# EAGLE design BitUCounter (EAGLE 9.2.2)
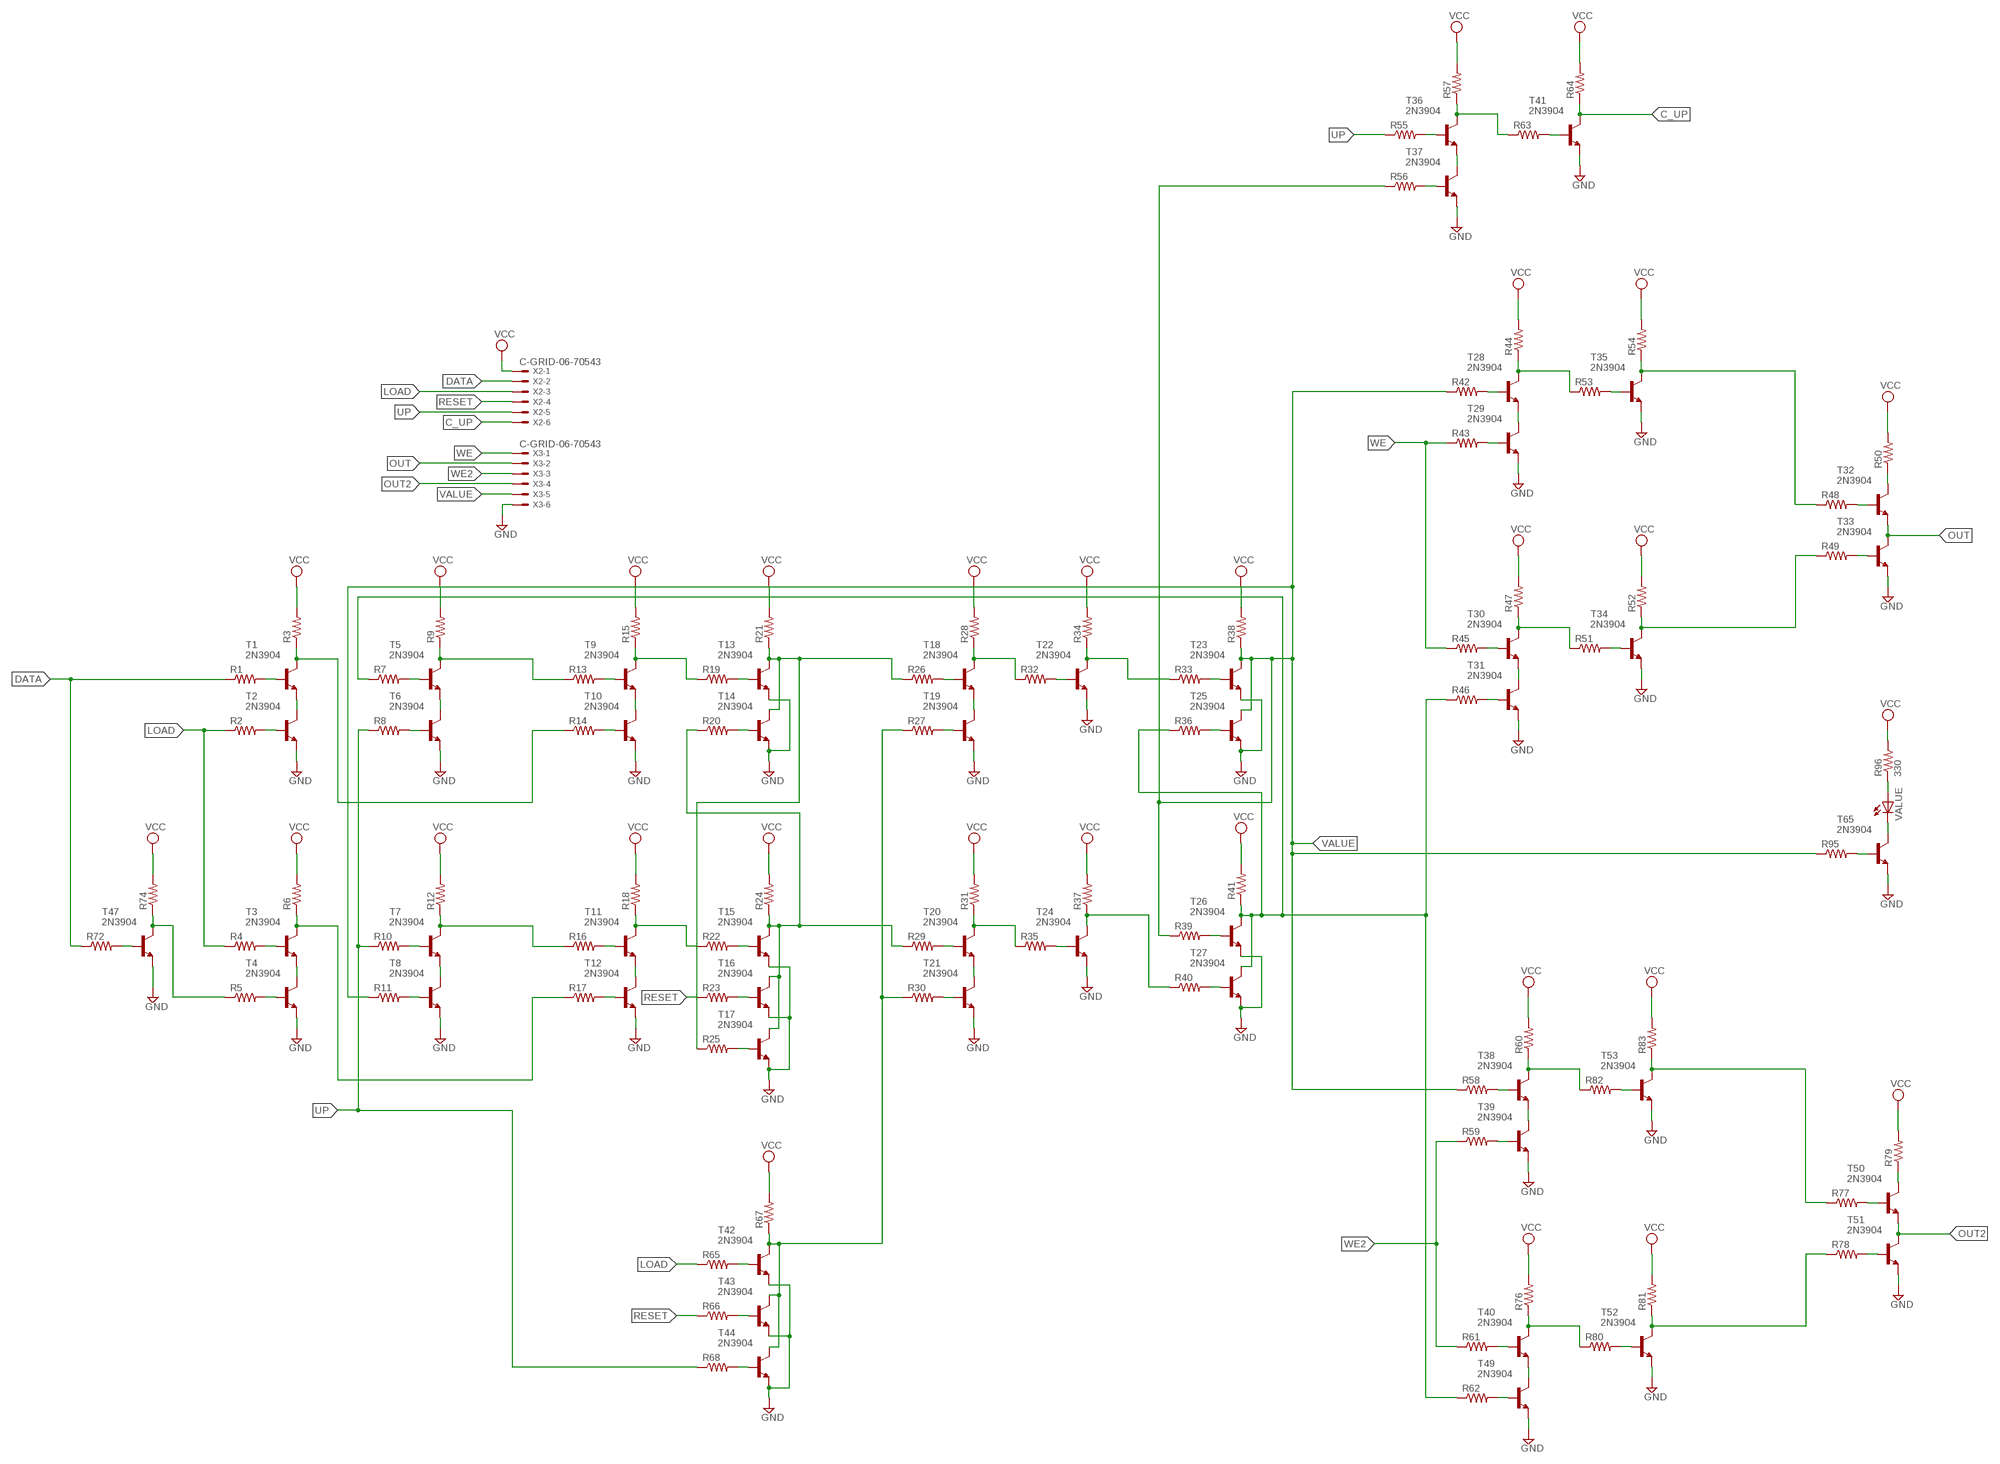
[diagram p0: schematic, sheet 1]

## Parts
R1  R-US_0309/10  [0309/10]
R2  R-US_0309/10  [0309/10]
R3  R-US_0309/10  [0309/10]
R4  R-US_0309/10  [0309/10]
R5  R-US_0309/10  [0309/10]
R6  R-US_0309/10  [0309/10]
R7  R-US_0309/10  [0309/10]
R8  R-US_0309/10  [0309/10]
R9  R-US_0309/10  [0309/10]
R10  R-US_0309/10  [0309/10]
R11  R-US_0309/10  [0309/10]
R12  R-US_0309/10  [0309/10]
R13  R-US_0309/10  [0309/10]
R14  R-US_0309/10  [0309/10]
R15  R-US_0309/10  [0309/10]
R16  R-US_0309/10  [0309/10]
R17  R-US_0309/10  [0309/10]
R18  R-US_0309/10  [0309/10]
R19  R-US_0309/10  [0309/10]
R20  R-US_0309/10  [0309/10]
R21  R-US_0309/10  [0309/10]
R22  R-US_0309/10  [0309/10]
R23  R-US_0309/10  [0309/10]
R24  R-US_0309/10  [0309/10]
R25  R-US_0309/10  [0309/10]
R26  R-US_0309/10  [0309/10]
R27  R-US_0309/10  [0309/10]
R28  R-US_0309/10  [0309/10]
R29  R-US_0309/10  [0309/10]
R30  R-US_0309/10  [0309/10]
R31  R-US_0309/10  [0309/10]
R32  R-US_0309/10  [0309/10]
R33  R-US_0309/10  [0309/10]
R34  R-US_0309/10  [0309/10]
R35  R-US_0309/10  [0309/10]
R36  R-US_0309/10  [0309/10]
R37  R-US_0309/10  [0309/10]
R38  R-US_0309/10  [0309/10]
R39  R-US_0309/10  [0309/10]
R40  R-US_0309/10  [0309/10]
R41  R-US_0309/10  [0309/10]
R42  R-US_0309/10  [0309/10]
R43  R-US_0309/10  [0309/10]
R44  R-US_0309/10  [0309/10]
R45  R-US_0309/10  [0309/10]
R46  R-US_0309/10  [0309/10]
R47  R-US_0309/10  [0309/10]
R48  R-US_0309/10  [0309/10]
R49  R-US_0309/10  [0309/10]
R50  R-US_0309/10  [0309/10]
R51  R-US_0309/10  [0309/10]
R52  R-US_0309/10  [0309/10]
R53  R-US_0309/10  [0309/10]
R54  R-US_0309/10  [0309/10]
R55  R-US_0309/10  [0309/10]
R56  R-US_0309/10  [0309/10]
R57  R-US_0309/10  [0309/10]
R58  R-US_0309/10  [0309/10]
R59  R-US_0309/10  [0309/10]
R60  R-US_0309/10  [0309/10]
R61  R-US_0309/10  [0309/10]
R62  R-US_0309/10  [0309/10]
R63  R-US_0309/10  [0309/10]
R64  R-US_0309/10  [0309/10]
R65  R-US_0309/10  [0309/10]
R66  R-US_0309/10  [0309/10]
R67  R-US_0309/10  [0309/10]
R68  R-US_0309/10  [0309/10]
R72  R-US_0309/10  [0309/10]
R74  R-US_0309/10  [0309/10]
R76  R-US_0309/10  [0309/10]
R77  R-US_0309/10  [0309/10]
R78  R-US_0309/10  [0309/10]
R79  R-US_0309/10  [0309/10]
R80  R-US_0309/10  [0309/10]
R81  R-US_0309/10  [0309/10]
R82  R-US_0309/10  [0309/10]
R83  R-US_0309/10  [0309/10]
R95  R-US_0309/10  [0309/10]
R96  330  R-US_0309/10  [0309/10]
T1  2N3904  [TO92]
T2  2N3904  [TO92]
T3  2N3904  [TO92]
T4  2N3904  [TO92]
T5  2N3904  [TO92]
T6  2N3904  [TO92]
T7  2N3904  [TO92]
T8  2N3904  [TO92]
T9  2N3904  [TO92]
T10  2N3904  [TO92]
T11  2N3904  [TO92]
T12  2N3904  [TO92]
T13  2N3904  [TO92]
T14  2N3904  [TO92]
T15  2N3904  [TO92]
T16  2N3904  [TO92]
T17  2N3904  [TO92]
T18  2N3904  [TO92]
T19  2N3904  [TO92]
T20  2N3904  [TO92]
T21  2N3904  [TO92]
T22  2N3904  [TO92]
T23  2N3904  [TO92]
T24  2N3904  [TO92]
T25  2N3904  [TO92]
T26  2N3904  [TO92]
T27  2N3904  [TO92]
T28  2N3904  [TO92]
T29  2N3904  [TO92]
T30  2N3904  [TO92]
T31  2N3904  [TO92]
T32  2N3904  [TO92]
T33  2N3904  [TO92]
T34  2N3904  [TO92]
T35  2N3904  [TO92]
T36  2N3904  [TO92]
T37  2N3904  [TO92]
T38  2N3904  [TO92]
T39  2N3904  [TO92]
T40  2N3904  [TO92]
T41  2N3904  [TO92]
T42  2N3904  [TO92]
T43  2N3904  [TO92]
T44  2N3904  [TO92]
T47  2N3904  [TO92]
T49  2N3904  [TO92]
T50  2N3904  [TO92]
T51  2N3904  [TO92]
T52  2N3904  [TO92]
T53  2N3904  [TO92]
T65  2N3904  [TO92]
VALUE  LED5MM  [LED5MM]
X2  C-GRID-06-70543  [70543-06]
X3  C-GRID-06-70543  [70543-06]

## Nets
C_UP: R64.1 T41.1(C) X2.6
DATA: R1.1 R72.1 X2.2
GND: T2.3(E) T4.3(E) T6.3(E) T8.3(E) T10.3(E) T12.3(E) T13.3(E) T14.3(E) T15.3(E) T16.3(E) T17.3(E) T19.3(E) T21.3(E) T22.3(E) T23.3(E) T24.3(E) T25.3(E) T26.3(E) T27.3(E) T29.3(E) T31.3(E) T33.3(E) T34.3(E) T35.3(E) T37.3(E) T39.3(E) T41.3(E) T42.3(E) T43.3(E) T44.3(E) T47.3(E) T49.3(E) T51.3(E) T52.3(E) T53.3(E) T65.3(E) X3.6
LOAD: R2.1 R4.1 R65.1 X2.3
N$1: R5.1 R74.1 T47.1(C)
N$2: R72.2 T47.2(B)
N$4: R7.1 R36.1 R41.1 R46.1 R62.1 T26.1(C) T27.1(C)
N$5: R6.1 R17.1 T3.1(C)
N$9: T3.3(E) T4.1(C)
N$10: R5.2 T4.2(B)
N$11: R4.2 T3.2(B)
N$12: R2.2 T2.2(B)
N$13: R1.2 T1.2(B)
N$14: T1.3(E) T2.1(C)
N$15: R3.1 R14.1 T1.1(C)
N$16: R9.1 R13.1 T5.1(C)
N$17: R7.2 T5.2(B)
N$18: R8.2 T6.2(B)
N$19: T5.3(E) T6.1(C)
N$20: R12.1 R16.1 T7.1(C)
N$21: R10.2 T7.2(B)
N$22: R11.2 T8.2(B)
N$23: T7.3(E) T8.1(C)
N$24: R18.1 R22.1 T11.1(C)
N$25: R16.2 T11.2(B)
N$26: R17.2 T12.2(B)
N$27: T11.3(E) T12.1(C)
N$28: R14.2 T10.2(B)
N$29: T9.3(E) T10.1(C)
N$30: R15.1 R19.1 T9.1(C)
N$31: R13.2 T9.2(B)
N$32: R21.1 R25.1 R26.1 T13.1(C) T14.1(C)
N$33: R58.2 T38.2(B)
N$34: R19.2 T13.2(B)
N$35: R20.2 T14.2(B)
N$36: R20.1 R24.1 R29.1 T15.1(C) T16.1(C) T17.1(C)
N$38: R59.2 T39.2(B)
N$39: T38.3(E) T39.1(C)
N$40: R22.2 T15.2(B)
N$41: R23.2 T16.2(B)
N$42: R25.2 T17.2(B)
N$43: R30.2 T21.2(B)
N$44: T20.3(E) T21.1(C)
N$45: R31.1 R35.1 T20.1(C)
N$46: R29.2 T20.2(B)
N$47: R35.2 T24.2(B)
N$48: R60.1 R82.1 T38.1(C)
N$49: R26.2 T18.2(B)
N$50: R27.2 T19.2(B)
N$51: T18.3(E) T19.1(C)
N$52: R28.1 R32.1 T18.1(C)
N$53: R32.2 T22.2(B)
N$54: R33.1 R34.1 T22.1(C)
N$55: R82.2 T53.2(B)
N$56: R77.1 R83.1 T53.1(C)
N$57: R78.1 R81.1 T52.1(C)
N$58: R36.2 T25.2(B)
N$59: R33.2 T23.2(B)
N$61: R80.2 T52.2(B)
N$62: R39.2 T26.2(B)
N$63: R40.2 T27.2(B)
N$64: R42.2 T28.2(B)
N$65: R43.2 T29.2(B)
N$66: T28.3(E) T29.1(C)
N$67: R44.1 R53.1 T28.1(C)
N$68: R53.2 T35.2(B)
N$69: R48.1 R54.1 T35.1(C)
N$70: R49.1 R52.1 T34.1(C)
N$71: R51.2 T34.2(B)
N$72: R47.1 R51.1 T30.1(C)
N$73: T30.3(E) T31.1(C)
N$74: R46.2 T31.2(B)
N$75: R45.2 T30.2(B)
N$76: R48.2 T32.2(B)
N$77: R50.1 T32.1(C)
N$78: R76.1 R80.1 T40.1(C)
N$79: R49.2 T33.2(B)
N$80: T40.3(E) T49.1(C)
N$81: R62.2 T49.2(B)
N$82: R61.2 T40.2(B)
N$83: R77.2 T50.2(B)
N$84: R57.1 R63.1 T36.1(C)
N$85: T36.3(E) T37.1(C)
N$86: R56.2 T37.2(B)
N$87: R55.2 T36.2(B)
N$88: R79.1 T50.1(C)
N$89: R63.2 T41.2(B)
N$90: R78.2 T51.2(B)
N$91: R65.2 T42.2(B)
N$97: R66.2 T43.2(B)
N$98: R68.2 T44.2(B)
N$100: R27.1 R30.1 R67.1 T42.1(C) T43.1(C) T44.1(C)
N$102: R37.1 R40.1 T24.1(C)
N$121: R96.1 VALUE.A
N$122: R95.2 T65.2(B)
N$124: T65.1(C) VALUE.K(C)
OUT: T32.3(E) T33.1(C) X3.2
OUT2: T50.3(E) T51.1(C) X3.4
RESET: R23.1 R66.1 X2.4
UP: R8.1 R10.1 R55.1 R68.1 X2.5
VALUE: R11.1 R38.1 R39.1 R42.1 R56.1 R58.1 R95.1 T23.1(C) T25.1(C) X3.5
VCC: R3.2 R6.2 R9.2 R12.2 R15.2 R18.2 R21.2 R24.2 R28.2 R31.2 R34.2 R37.2 R38.2 R41.2 R44.2 R47.2 R50.2 R52.2 R54.2 R57.2 R60.2 R64.2 R67.2 R74.2 R76.2 R79.2 R81.2 R83.2 R96.2 X2.1
WE: R43.1 R45.1 X3.1
WE2: R59.1 R61.1 X3.3

## Library data of the parts
R1-R68 R72 R74 R76-R83 R95 R96 = resistor:R-US_: RESISTOR, American symbol
T1-T44 T47 T49-T53 T65 = transistor:2N3904: NPN TRANSISTOR
VALUE = led:LED: LED OSRAM: - CHIPLED LG R971, LG N971, LY N971, LG Q971, LY Q971, LO R971, LY R971 LH N974, LH R974 LS Q976, LO Q976, LY Q976 LO Q996 - Hyper CHIPLED LW Q18S LB Q993, LB Q99A, LB R99A - SideLED LS A670, LO A670, LY A670, LG A670, LP A670 LB A673, LV A673, LT A673, LW A673 LH A674 LY A675 LS A676, LA A676, LO A676, LY A676, LW A676 LS A679, LY A679, LG A679 - Hyper Micro SIDELED® LS Y876, LA Y876, LO Y876, LY Y876 LT Y87S - SmartLED LW L88C, LW L88S LB L89C, LB L89S, LG L890 LS L89K, LO L89K, LY L89K LS L896, LA L896, LO L896, LY L896 - TOPLED LS T670, LO T670, LY T670, LG T670, LP T670 LSG T670, LSP T670, LSY T670, LOP T670, LYG T670 LG T671, LOG T671, LSG T671 LB T673, LV T673, LT T673, LW T673 LH T674 LS T676, LA T676, LO T676, LY T676, LB T676, LH T676, LSB T676, LW T676 LB T67C, LV T67C, LT T67C, LS T67K, LO T67K, LY T67K, LW E67C LS E67B, LA E67B, LO E67B, LY E67B, LB E67C, LV E67C, LT E67C LW T67C LS T679, LY T679, LG T679 LS T770, LO T770, LY T770, LG T770, LP T770 LB T773, LV T773, LT T773, LW T773 LH T774 LS E675, LA E675, LY E675, LS T675 LS T776, LA T776, LO T776, LY T776, LB T776 LHGB T686 LT T68C, LB T68C - Hyper Mini TOPLED® LB M676 - Mini TOPLED Santana® LG M470 LS M47K, LO M47K, LY M47K Source: http://www.osram.convergy.de LUXEON: - LUMILED® LXK2-PW12-R00, LXK2-PW12-S00, LXK2-PW14-U00, LXK2-PW14-V00 LXK2-PM12-R00, LXK2-PM12-S00, LXK2-PM14-U00 LXK2-PE12-Q00, LXK2-PE12-R00, LXK2-PE12-S00, LXK2-PE14-T00, LXK2-PE14-U00 LXK2-PB12-K00, LXK2-PB12-L00, LXK2-PB12-M00, LXK2-PB14-N00, LXK2-PB14-P00, LXK2-PB14-Q00 LXK2-PR12-L00, LXK2-PR12-M00, LXK2-PR14-Q00, LXK2-PR14-R00 LXK2-PD12-Q00, LXK2-PD12-R00, LXK2-PD12-S00 LXK2-PH12-R00, LXK2-PH12-S00 LXK2-PL12-P00, LXK2-PL12-Q00, LXK2-PL12-R00 Source: www.luxeon.com KINGBRIGHT: KA-3528ASYC Source: www.kingbright.com
X2 X3 = con-molex:C-GRID-06: CONNECTOR wire to board 2.54 mm (0.100") pitch header; MF: MOLEX; OC_FARNELL: unknown; OC_NEWARK: unknown

## Board
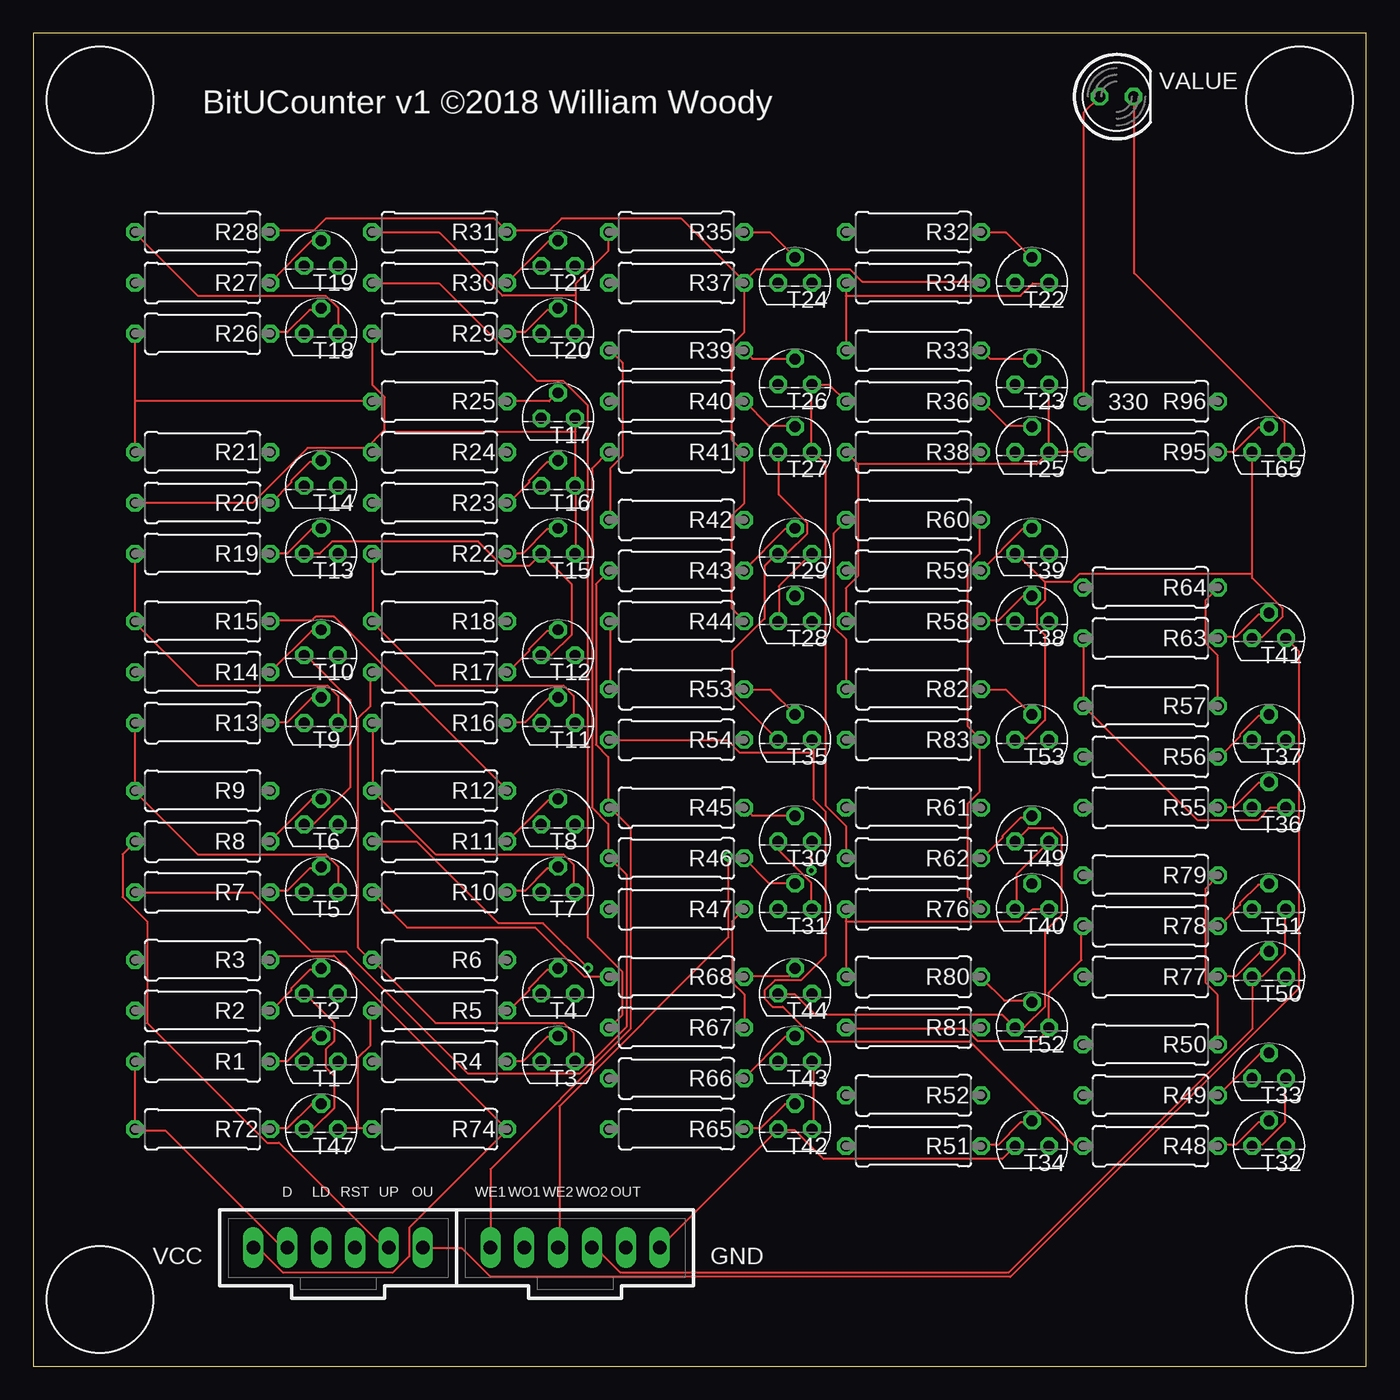
[diagram p1: board, top side]
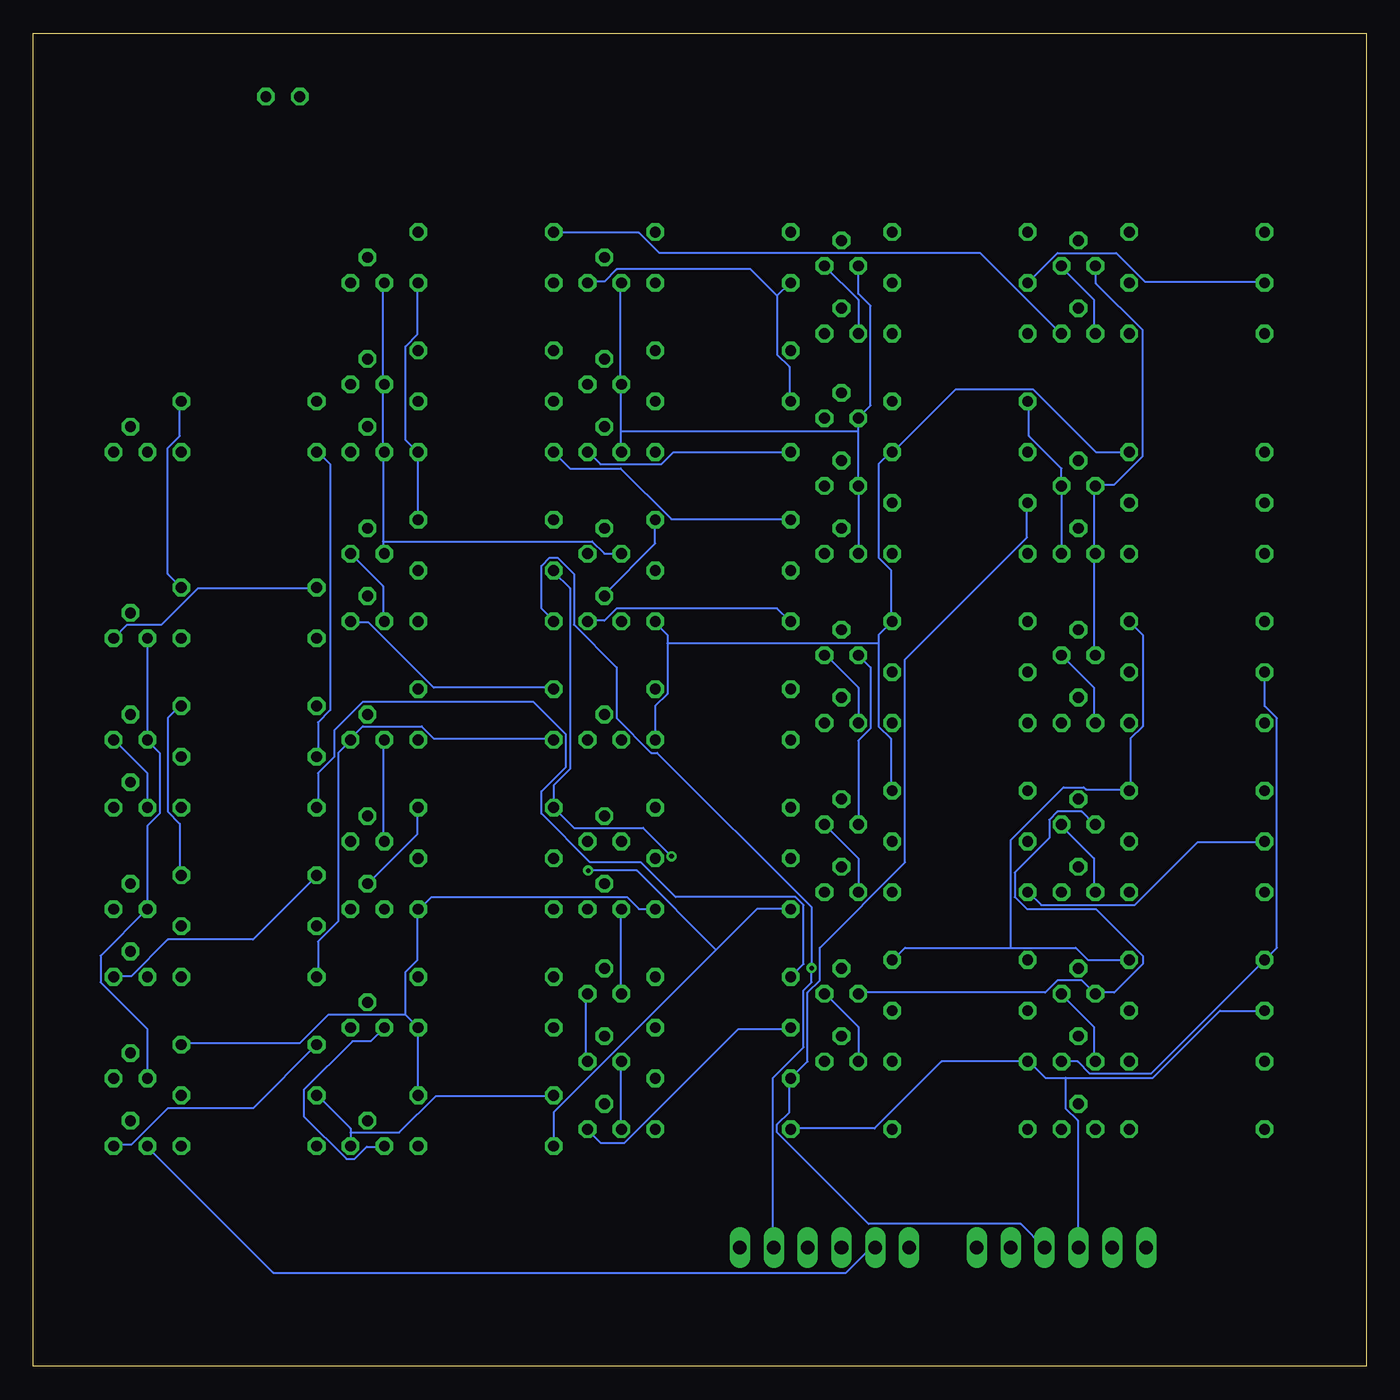
[diagram p2: board, bottom side, seen from below]

Size 100 x 100 mm. Coordinates in mm from the lower left corner, seen from the top.
Outline: 0,0 100,0 100,100 0,100 0,0
Copper layers (1*16): Top 0.035mm / dielectric 1.5mm / Bottom 0.035mm
Design rules "default": minimum track width 6mil, minimum drill 0.35mm, track to track 6mil, track to pad 6mil, pad to pad 6mil, via to via 6mil, smd to smd 6mil, copper to edge 40mil, drill to drill 6mil, minimum pad ring 10mil, minimum via ring 8mil, stop-mask expansion 4mil, vias tented up to drill 0mil, thermal gap 10mil

### Footprints (pad centres in the part's own frame; a part is rotated, then mirrored left to right if it is on the bottom)
0309/10 = drill 0.813 octagon: 1 -5.08,0; 2 5.08,0
TO92 = drill 0.813 octagon: 1 1.27,0; 2 0,1.905; 3 -1.27,0
LED5MM = drill 0.813 octagon: A -1.27,0; K 1.27,0
70543-06 = drill 1.016 long: 1 -6.35,0; 2 -3.81,0; 3 -1.27,0; 4 1.27,0; 5 3.81,0; 6 6.35,0

### Placement (x,y rotation side)
R1  12.7,22.86 0 top
R2  12.7,26.67 0 top
R3  12.7,30.48 0 top
R4  30.48,22.86 0 top
R5  30.48,26.67 0 top
R6  30.48,30.48 0 top
R7  12.7,35.56 0 top
R8  12.7,39.37 0 top
R9  12.7,43.18 0 top
R10  30.48,35.56 0 top
R11  30.48,39.37 0 top
R12  30.48,43.18 0 top
R13  12.7,48.26 0 top
R14  12.7,52.07 0 top
R15  12.7,55.88 0 top
R16  30.48,48.26 0 top
R17  30.48,52.07 0 top
R18  30.48,55.88 0 top
R19  12.7,60.96 0 top
R20  12.7,64.77 0 top
R21  12.7,68.58 0 top
R22  30.48,60.96 0 top
R23  30.48,64.77 0 top
R24  30.48,68.58 0 top
R25  30.48,72.39 0 top
R26  12.7,77.47 0 top
R27  12.7,81.28 0 top
R28  12.7,85.09 0 top
R29  30.48,77.47 0 top
R30  30.48,81.28 0 top
R31  30.48,85.09 0 top
R32  66.04,85.09 0 top
R33  66.04,76.2 0 top
R34  66.04,81.28 0 top
R35  48.26,85.09 0 top
R36  66.04,72.39 0 top
R37  48.26,81.28 0 top
R38  66.04,68.58 0 top
R39  48.26,76.2 0 top
R40  48.26,72.39 0 top
R41  48.26,68.58 0 top
R42  48.26,63.5 0 top
R43  48.26,59.69 0 top
R44  48.26,55.88 0 top
R45  48.26,41.91 0 top
R46  48.26,38.1 0 top
R47  48.26,34.29 0 top
R48  83.82,16.51 0 top
R49  83.82,20.32 0 top
R50  83.82,24.13 0 top
R51  66.04,16.51 0 top
R52  66.04,20.32 0 top
R53  48.26,50.8 0 top
R54  48.26,46.99 0 top
R55  83.82,41.91 0 top
R56  83.82,45.72 0 top
R57  83.82,49.53 0 top
R58  66.04,55.88 0 top
R59  66.04,59.69 0 top
R60  66.04,63.5 0 top
R61  66.04,41.91 0 top
R62  66.04,38.1 0 top
R63  83.82,54.61 0 top
R64  83.82,58.42 0 top
R65  48.26,17.78 0 top
R66  48.26,21.59 0 top
R67  48.26,25.4 0 top
R68  48.26,29.21 0 top
R72  12.7,17.78 0 top
R74  30.48,17.78 0 top
R76  66.04,34.29 0 top
R77  83.82,29.21 0 top
R78  83.82,33.02 0 top
R79  83.82,36.83 0 top
R80  66.04,29.21 0 top
R81  66.04,25.4 0 top
R82  66.04,50.8 0 top
R83  66.04,46.99 0 top
R95  83.82,68.58 0 top
R96  83.82,72.39 0 top
T1  21.59,22.86 0 top
T2  21.59,27.94 0 top
T3  39.37,22.86 0 top
T4  39.37,27.94 0 top
T5  21.59,35.56 0 top
T6  21.59,40.64 0 top
T7  39.37,35.56 0 top
T8  39.37,40.64 0 top
T9  21.59,48.26 0 top
T10  21.59,53.34 0 top
T11  39.37,48.26 0 top
T12  39.37,53.34 0 top
T13  21.59,60.96 0 top
T14  21.59,66.04 0 top
T15  39.37,60.96 0 top
T16  39.37,66.04 0 top
T17  39.37,71.12 0 top
T18  21.59,77.47 0 top
T19  21.59,82.55 0 top
T20  39.37,77.47 0 top
T21  39.37,82.55 0 top
T22  74.93,81.28 0 top
T23  74.93,73.66 0 top
T24  57.15,81.28 0 top
T25  74.93,68.58 0 top
T26  57.15,73.66 0 top
T27  57.15,68.58 0 top
T28  57.15,55.88 0 top
T29  57.15,60.96 0 top
T30  57.15,39.37 0 top
T31  57.15,34.29 0 top
T32  92.71,16.51 0 top
T33  92.71,21.59 0 top
T34  74.93,16.51 0 top
T35  57.15,46.99 0 top
T36  92.71,41.91 0 top
T37  92.71,46.99 0 top
T38  74.93,55.88 0 top
T39  74.93,60.96 0 top
T40  74.93,34.29 0 top
T41  92.71,54.61 0 top
T42  57.15,17.78 0 top
T43  57.15,22.86 0 top
T44  57.15,27.94 0 top
T47  21.59,17.78 0 top
T49  74.93,39.37 0 top
T50  92.71,29.21 0 top
T51  92.71,34.29 0 top
T52  74.93,25.4 0 top
T53  74.93,46.99 0 top
T65  92.71,68.58 0 top
VALUE  81.28,95.25 0 top
X2  22.86,8.89 0 top
X3  40.64,8.89 0 top

### Tracks (layer width: path | path; a pad name or v marks a point on that pad's centre or on a via)
C_UP
  Top 0.152: T41.1 94.94,53.65 94.94,28.35 73.3,6.71 34.29,6.71 32.16,8.84 29.26,8.84 X2.6
  Bottom 0.152: T41.1 92.96,55.63 90.37,55.63 87.63,58.37 78.79,58.37 R64.1
DATA
  Top 0.152: R1.1 R72.1 7.62,17.68 9.91,17.68 18.59,8.99 19.05,8.99 X2.2
GND
  Top 0.152: T47.3 20.42,17.83 21.03,17.83 22.55,19.36 22.55,21.79 21.95,22.4 21.95,23.77 22.55,24.38 22.55,25.76 20.42,27.89 T2.3 | T6.3 20.42,40.69 21.03,40.69 23.77,43.43 23.77,49.99 20.42,53.34 T10.3 | T35.3 52.43,50.44 52.43,53.65 54.86,56.08 54.86,60.05 55.78,60.96 T29.3 56.54,60.96 58.06,62.48 58.06,63.25 55.93,65.38 55.93,68.58 T27.3 | T12.3 38.86,53.34 40.39,54.86 40.39,58.67 T15.3 37.19,60.05 35.2,60.05 33.38,61.87 22.4,61.87 21.49,60.96 T13.3 | X3.6 T42.3 55.93,17.68 57.15,17.68 59.28,15.54 72.69,15.54 T34.3 | T44.3 55.93,27.89 57.15,27.89 58.67,26.36 72.69,26.36 T52.3 73.76,25.45 74.37,25.45 75.89,26.98 75.89,32.61 77.11,33.83 77.11,39.78 76.5,40.39 74.68,40.39 T49.3 | 75.89,58.83 75.89,57.45 75.29,56.84 75.29,55.47 75.89,54.86 75.89,48.46 74.52,47.09 73.76,47.09 T53.3 | 75.89,58.83 73.76,60.96 T39.3 | 91.44,59.44 91.44,59.13 93.73,56.84 93.73,56.24 92.2,54.71 91.44,54.71 T41.3 | 91.44,59.44 T65.3 | 75.89,58.83 77.88,58.83 78.49,59.44 91.44,59.44
  Bottom 0.152: T4.3 38.1,28.04 24.08,28.04 23.16,28.96 21.34,28.96 T2.3 20.27,28.04 18.9,28.04 16.76,30.18 16.76,30.79 20.27,34.29 25.45,34.29 26.36,35.2 26.36,37.03 23.77,39.62 23.77,41 23.16,41.6 21.34,41.6 20.42,40.69 T6.3 | 20.42,60.96 20.42,65.99 T14.3 20.27,66.14 18.9,66.14 16.76,68.28 16.76,77.72 20.27,81.23 20.27,82.45 T19.3 | 20.42,60.96 20.42,53.34 T10.3 | 20.42,60.96 T13.3 | 55.93,70.1 55.93,73.61 T26.3 55.93,73.76 55.93,81.23 T24.3 | 55.93,70.1 55.93,68.58 T27.3 | T8.3 38.1,46.94 37.19,47.85 37.19,52.43 T12.3 | T15.3 T16.3 38.1,70.1 | 38.1,70.1 T17.3 38.1,71.17 37.19,72.08 37.19,79.55 38.1,80.47 T21.3 | 38.1,70.1 55.93,70.1 | T42.3 55.93,17.83 55.93,22.86 T43.3 | T44.3 55.93,28.04 55.93,34.29 T31.3 | T52.3 74.68,24.38 76.05,24.38 79.7,20.73 79.7,18.75 76.5,15.54 75.89,15.54 74.98,16.46 73.76,16.46 T34.3 | T49.3 73.76,39.47 73.76,46.94 T53.3 | 73.76,68.58 73.76,61.87 | 73.76,61.87 73.76,60.96 T39.3 | 73.76,68.58 73.76,73.61 T23.3 73.76,73.76 73.76,81.23 T22.3 | 73.76,68.58 T25.3 | T33.3 91.44,25.3 94.94,28.8 94.94,30.79 T51.3 91.44,40.54 90.53,41.45 90.53,46.02 91.44,46.94 T37.3 T41.3 | T29.3 57.15,60.96 58.06,61.87 73.76,61.87
LOAD
  Bottom 0.152: R2.1 10.97,26.67 16,21.64 22.55,21.64 | 22.55,21.64 24.08,21.64 25.3,22.86 R4.1 31.85,22.86 36.88,17.83 43.13,17.83 R65.1 | 22.55,21.64 22.55,19.36 21.64,18.44 21.64,8.99 X2.3
N$1
  Top 0.152: 24.38,17.83 25.3,17.83 R74.1 | 24.38,17.83 22.86,17.83 T47.1 | 24.38,17.83 24.38,23.16 25.3,24.08 25.3,26.67 R5.1
N$2
  Top 0.152: R72.2 17.83,17.83 19.05,17.83 20.88,19.66 21.49,19.66 T47.2
N$4
  Top 0.152: R7.1 7.62,35.51 16.46,35.51 20.88,31.09 23.47,31.09 32.61,21.95 41,21.95 44.5,25.45 44.5,36.88 43.28,38.1 R46.1 43.13,38.1 43.13,40.69 41.91,41.91 41.91,67.36 43.13,68.58 R41.1 | R36.1 59.74,73.61 58.52,73.61 T26.1 58.37,73.61 58.37,68.58 T27.1 58.52,68.58 59.44,67.67 59.44,42.06 60.96,40.54 R62.1
  Bottom 0.152: R41.1 51.97,68.58 52.88,67.67 57.45,67.67 58.37,68.58 T27.1
N$5
  Top 0.152: T3.1 40.54,22.86 40.54,24.99 39.78,25.76 30.18,25.76 25.45,30.48 R6.1 25.3,30.48 24.38,31.39 24.38,48.62 25.3,49.53 25.3,51.97 R17.1
N$9
  Bottom 0.152: T3.3 38.1,25.45 40.54,27.89 T4.1
N$10
  Top 0.152: R5.2 35.66,26.67 37.19,28.19 37.19,28.35 38.56,29.72 39.32,29.72 T4.2
N$11
  Top 0.152: R4.2 36.73,22.86 38.56,24.69 39.32,24.69 T3.2
N$12
  Top 0.152: R2.2 17.83,26.67 19.36,28.19 19.36,28.35 20.73,29.72 21.49,29.72 T2.2
N$13
  Top 0.152: R1.2 19.05,22.86 20.88,24.69 21.49,24.69 T1.2
N$14
  Bottom 0.152: T1.3 20.42,22.86 20.42,25.45 22.86,27.89 T2.1
N$15
  Bottom 0.152: T1.1 21.64,22.86 20.73,21.95 16.15,21.95 R3.1 6.71,31.39 6.71,48.62 7.62,49.53 R14.1
N$16
  Top 0.152: R13.1 R9.1 7.62,43.13 12.34,38.41 21.95,38.41 22.86,37.49 T5.1
N$17
  Top 0.152: R7.2 17.83,35.66 19.05,35.66 20.73,37.34 21.49,37.34 T5.2
N$18
  Top 0.152: R8.2 17.83,39.47 20.88,42.52 21.49,42.52 T6.2
N$19
  Bottom 0.152: T5.3 20.42,35.66 20.42,38.1 22.86,40.54 T6.1
N$20
  Top 0.152: R16.1 25.45,48.16 25.45,43.28 R12.1 30.18,38.41 39.78,38.41 40.54,37.64 40.54,35.66 T7.1
N$21
  Top 0.152: R10.2 35.66,35.66 36.88,35.66 38.56,37.34 39.32,37.34 T7.2
N$22
  Top 0.152: R11.2 38.71,42.52 39.32,42.52 T8.2
N$23
  Bottom 0.152: T7.3 38.1,38.1 T8.1
N$24
  Top 0.152: R22.1 25.45,60.96 25.45,55.93 R18.1 25.45,55.78 30.18,51.05 39.78,51.05 40.54,50.29 40.54,48.31 T11.1
N$25
  Top 0.152: R16.2 35.66,48.31 36.88,48.31 38.71,50.14 39.32,50.14 T11.2
N$26
  Top 0.152: R17.2 35.66,52.12 37.19,53.65 37.19,53.8 38.56,55.17 39.32,55.17 T12.2
N$27
  Bottom 0.152: T11.3 38.1,50.9 40.54,53.34 T12.1
N$28
  Top 0.152: R14.2 20.88,55.17 21.49,55.17 T10.2
N$29
  Bottom 0.152: T10.1 20.42,50.9 20.42,48.31 T9.3
N$30
  Top 0.152: R19.1 R15.1 7.62,55.78 12.34,51.05 22.1,51.05 22.86,50.29 T9.1
N$31
  Top 0.152: R13.2 17.83,48.31 19.05,48.31 20.88,50.14 21.49,50.14 T9.2
N$32
  Top 0.152: R26.1 7.62,72.39 | 7.62,72.39 R21.1 | R25.1 7.62,72.39
  Bottom 0.152: T13.1 T14.1 22.86,67.36 25.3,69.8 25.3,72.39 R25.1
N$33
  Top 0.152: R58.2 71.17,55.93 72.39,55.93 74.22,57.76 74.83,57.76 T38.2
N$34
  Top 0.152: R19.2 19.05,60.96 20.88,62.79 21.49,62.79 T13.2
N$35
  Top 0.152: R20.2 17.83,64.77 19.36,66.29 19.36,66.45 20.73,67.82 21.49,67.82 T14.2
N$36
  Top 0.152: T15.1 40.69,60.96 40.69,65.99 T16.1 40.69,66.14 40.69,70.1 | 40.69,70.1 40.69,71.02 T17.1 | R20.1 16.46,64.77 20.57,68.89 24.99,68.89 | 24.99,68.89 25.3,68.58 R24.1 24.99,68.89 | 24.99,68.89 26.21,70.1 | 26.21,70.1 26.36,70.26 26.36,72.69 25.45,73.61 25.45,77.42 R29.1 | 26.21,70.1 40.69,70.1
N$38
  Top 0.152: R59.2 74.22,62.79 74.83,62.79 T39.2
N$39
  Bottom 0.152: T39.1 73.76,58.52 73.76,55.93 T38.3
N$40
  Top 0.152: R22.2 36.73,60.96 38.56,62.79 39.32,62.79 T15.2
N$41
  Top 0.152: R23.2 35.66,64.77 37.19,66.29 37.19,66.45 38.56,67.82 39.32,67.82 T16.2
N$42
  Top 0.152: R25.2 38.71,72.39 39.32,73 T17.2
N$43
  Top 0.152: R30.2 38.71,84.43 39.32,84.43 T21.2
N$44
  Bottom 0.152: T20.3 38.1,80.01 T21.1
N$45
  Top 0.152: 40.69,80.31 40.69,81.23 43.13,83.67 43.13,85.04 R35.1 | 40.69,80.31 40.69,77.57 T20.1 | 40.69,80.31 35.2,80.31 30.48,85.04 25.45,85.04 R31.1
N$46
  Top 0.152: R29.2 35.66,77.57 36.88,77.57 38.56,79.25 39.32,79.25 T20.2
N$47
  Top 0.152: R35.2 53.34,85.04 55.32,85.04 57.15,83.21 T24.2
N$48
  Top 0.152: R82.1 60.96,54.56 60.05,55.47 60.05,62.48 60.96,63.4 R60.1
  Bottom 0.152: T38.1 76.2,55.78 74.83,55.78 69.95,50.9 60.96,50.9 R82.1
N$49
  Top 0.152: R26.2 17.83,77.57 19.05,77.57 20.73,79.25 21.49,79.25 T18.2
N$50
  Top 0.152: R27.2 17.83,81.38 20.88,84.43 21.49,84.43 T19.2
N$51
  Bottom 0.152: T18.3 20.42,77.57 20.42,80.01 22.86,82.45 T19.1
N$52
  Top 0.152: T18.1 22.86,79.4 21.95,80.31 12.34,80.31 7.62,85.04 R28.1
  Bottom 0.152: R32.1 60.96,85.04 54.56,85.04 53.03,83.52 28.96,83.52 22.86,77.42 T18.1
N$53
  Top 0.152: R32.2 71.17,85.04 73,85.04 74.83,83.21 T22.2
N$54
  Top 0.152: R34.1 60.96,80.31 | 60.96,80.31 R33.1 | 60.96,80.31 74.07,80.31 74.98,81.23 76.2,81.23 T22.1
N$55
  Top 0.152: R82.2 71.17,50.75 73,50.75 74.83,48.92 T53.2
N$56
  Bottom 0.152: R83.1 60.96,47.09 69.95,47.09 70.87,48.01 75.29,48.01 76.2,47.09 T53.1 76.2,46.94 77.11,46.02 77.11,33.38 78.64,31.85 78.64,29.26 R77.1
N$57
  Top 0.152: R81.1 60.96,25.3 69.95,25.3 70.87,24.38 75.29,24.38 76.2,25.3 T52.1 76.2,28.04 78.64,30.48 78.64,32.92 R78.1
N$58
  Top 0.152: T25.2 74.83,70.56 73,70.56 71.17,72.39 R36.2
N$59
  Top 0.152: T23.2 74.83,75.59 71.78,75.59 71.17,76.2 R33.2
N$61
  Top 0.152: T52.2 74.83,27.43 72.85,27.43 71.17,29.11 R80.2
N$62
  Top 0.152: R39.2 53.95,75.59 57.15,75.59 T26.2
N$63
  Top 0.152: R40.2 55.17,70.56 57.15,70.56 T27.2
N$64
  Bottom 0.152: R42.2 53.34,61.72 57.15,57.91 T28.2
N$65
  Top 0.152: R43.2 53.34,59.74 56.39,62.79 57.15,62.79 T29.2
N$66
  Top 0.152: T28.3 55.93,55.93 55.93,58.52 58.37,60.96 T29.1
N$67
  Top 0.152: R53.1 43.28,50.9 43.28,55.78 R44.1
  Bottom 0.152: T28.1 58.37,55.93 57.15,55.93 56.24,56.84 44.2,56.84 43.28,55.93 R44.1
N$68
  Top 0.152: R53.2 53.34,50.75 55.32,50.75 57.15,48.92 T35.2
N$69
  Top 0.152: 58.52,46.02 58.52,46.94 T35.1 | 58.52,46.02 58.52,42.52 59.44,41.6 59.44,30.79 57.61,28.96 55.63,28.96 54.86,28.19 54.86,27.58 55.47,26.98 56.24,26.98 58.83,24.38 70.26,24.38 78.03,16.61 78.64,16.61 R48.1 | 58.52,46.02 53.03,46.02 52.12,46.94 43.28,46.94 R54.1
N$70
  Bottom 0.152: 76.2,17.53 76.2,17.83 78.64,20.27 R49.1 | 76.2,17.53 T34.1 | 76.2,17.53 72.54,17.53 69.8,20.27 60.96,20.27 R52.1
N$71
  Top 0.152: R51.2 71.17,16.61 72.39,16.61 74.07,18.29 74.83,18.29 T34.2
N$72  (via drill 0.35)
  Top 0.152: v58.37,37.19 58.37,39.32 T30.1
  Bottom 0.152: R51.1 60.96,19.05 48.77,31.24 | 48.77,31.24 45.72,34.29 R47.1 | v58.37,37.19 54.71,37.19 48.77,31.24
N$73
  Top 0.152: T30.3 55.93,39.32 55.93,38.71 58.37,36.27 58.37,34.29 T31.1
N$74
  Top 0.152: R46.2 55.17,36.27 57.15,36.27 T31.2
N$75
  Top 0.152: R45.2 53.95,41.3 57.15,41.3 T30.2
N$76
  Top 0.152: R48.2 89,16.61 90.22,16.61 91.9,18.29 92.66,18.29 T32.2
N$77
  Bottom 0.152: R50.1 83.52,19.36 89.92,19.36 92.66,16.61 93.88,16.61 T32.1
N$78
  Top 0.152: R76.1 60.96,33.38 | 60.96,33.38 R80.1 | T40.1 74.98,34.29 74.07,33.38 60.96,33.38
N$79
  Top 0.152: R49.2 92.05,23.47 92.66,23.47 T33.2
N$80
  Top 0.152: T40.3 73.76,34.29 73.76,36.88 76.2,39.32 T49.1
N$81
  Top 0.152: R62.2 71.17,38.1 72.69,39.62 72.69,39.78 74.07,41.15 74.83,41.15 T49.2
N$82
  Bottom 0.152: R61.2 71.17,41.91 71.17,39.93 74.83,36.27 T40.2
N$83
  Top 0.152: R77.2 89,29.26 90.22,29.26 92.05,31.09 92.66,31.09 T50.2
N$84
  Top 0.152: 78.79,49.53 78.79,54.56 R63.1 | T36.1 92.81,41.91 91.9,41 87.33,41 78.79,49.53 | 78.79,49.53 R57.1
N$85
  Bottom 0.152: T36.3 91.44,44.5 93.88,46.94 T37.1
N$86
  Top 0.152: R56.2 89,45.72 90.53,47.24 90.53,47.4 91.9,48.77 92.66,48.77 T37.2
N$87
  Top 0.152: R55.2 90.07,41.91 91.9,43.74 92.66,43.74 T36.2
N$88
  Bottom 0.152: T50.1 93.88,29.26 92.66,29.26 89.92,32 83.52,32 78.79,36.73 R79.1
N$89
  Top 0.152: R63.2 89,54.71 90.22,54.71 91.9,56.39 92.66,56.39 T41.2
N$90
  Top 0.152: R78.2 89,33.07 90.53,34.59 90.53,34.75 91.9,36.12 92.66,36.12 T51.2
N$91
  Top 0.152: R65.2 53.34,17.83 54.56,17.83 56.39,19.66 57.15,19.66 T42.2
N$97
  Top 0.152: R66.2 53.34,21.64 56.39,24.69 57.15,24.69 T43.2
N$98
  Top 0.152: R68.2 53.34,29.26 56.69,29.26 57.15,29.72 T44.2
N$100
  Top 0.152: T42.1 58.52,17.83 58.52,22.86 T43.1 | R30.1 25.45,81.23 30.48,81.23 37.8,73.91 39.78,73.91 41.6,72.08 41.6,32.16 44.2,29.57 44.2,26.36 43.28,25.45 R67.1
  Bottom 0.152: R30.1 23.16,83.52 18.75,83.52 16.61,81.38 7.62,81.38 R27.1 | R67.1 43.28,25.3 47.09,25.3 55.63,16.76 57.45,16.76 58.37,17.68 T42.1 | T44.1 58.52,27.89 58.52,22.86 T43.1
N$102
  Bottom 0.152: 44.2,80.31 44.2,75.89 43.28,74.98 43.28,72.39 R40.1 | 44.2,80.31 43.28,81.23 R37.1 | 44.2,80.31 46.18,82.3 56.24,82.3 57.15,81.38 58.37,81.38 T24.1
N$121
  Top 0.152: VALUE.A 78.79,94.03 78.79,72.39 R96.1
N$122
  Top 0.152: R95.2 90.07,68.58 91.9,70.41 92.66,70.41 T65.2
N$124
  Top 0.152: VALUE.K 82.6,95.25 82.6,81.99 93.88,70.71 93.88,68.58 T65.1
OUT
  Top 0.152: T32.3 91.44,16.61 92.2,16.61 93.88,18.29 93.88,21.49 T33.1
  Bottom 0.152: X3.2 36.88,8.84 37.19,8.84 39.01,7.01 81.99,7.01 91.44,16.46 T32.3
OUT2
  Top 0.152: T51.1 93.88,34.29 93.88,30.94 92.2,29.26 91.44,29.26 T50.3 91.44,25.3 73.15,7.01 44.04,7.01 42.22,8.84 41.91,8.84 X3.4
RESET
  Bottom 0.152: X2.4 25.91,10.67 37.34,10.67 44.2,17.53 44.2,18.14 43.28,19.05 43.28,21.49 R66.1 41.91,22.86 41.91,28.04 41,28.96 41,31.39 34.59,37.8 34.59,53.03 25.45,62.18 25.45,64.77 R23.1
UP
  Top 0.152: R10.1 28.04,32.92 37.64,32.92 41.3,29.26 43.13,29.26 R68.1 | X2.5 26.67,8.99 26.21,8.99 18.44,16.76 17.53,16.76 8.53,25.76 8.53,33.38 6.71,35.2 6.71,38.41 7.62,39.32 R8.1
  Bottom 0.152: R8.1 7.62,39.32 12.65,39.32 17.37,34.59 24.38,34.59 25.3,35.51 R10.1 | R68.1 42.22,30.18 42.22,34.59 42.82,35.2 51.82,35.2 54.41,37.8 58.22,37.8 61.87,41.45 61.87,43.13 60.05,44.96 60.05,47.4 62.48,49.84 75.29,49.84 77.42,47.7 77.42,45.72 78.64,44.5 78.64,41.91 R55.1
VALUE  (via drill 0.35)
  Top 0.152: v41.6,29.87 38.25,33.22 34.9,33.22 28.8,39.32 25.45,39.32 R11.1 | R42.1 43.28,63.55 43.28,67.36 44.2,68.28 44.2,75.29 43.28,76.2 R39.1 | R58.1 60.96,58.37 61.87,59.28 61.87,67.67 | R38.1 61.87,67.67 | R95.1 T25.1 | T25.1 T23.1 | 61.87,67.67 75.29,67.67 T25.1
  Bottom 0.152: X3.5 44.5,8.99 44.5,21.64 42.22,23.93 42.22,28.19 41.6,28.8 v41.6,29.87 41.6,34.44 53.19,46.02 53.65,46.02 56.24,48.62 56.24,52.43 59.44,55.63 59.44,59.44 60.66,60.66 61.27,60.66 61.87,60.05 61.87,56.84 60.96,55.93 R58.1 | R56.1 78.64,45.72 78.64,48.31 77.72,49.23 77.72,67.67 78.64,68.58 R95.1 | R38.1 59.74,67.36 55.93,67.36 52.12,63.55 43.28,63.55 R42.1
VCC
  Top 0.152: R50.2 88.85,24.23 88.85,27.89 87.94,28.8 87.94,35.81 88.85,36.73 R79.2 | R64.2 87.94,57.45 87.94,54.25 88.85,53.34 88.85,49.53 R57.2 | R67.2 53.34,27.89 52.43,28.8 52.43,33.38 R47.2 | R76.2 71.02,34.29 70.1,35.2 70.1,42.22 71.02,43.13 71.02,46.94 R83.2 70.1,48.01 70.1,60.05 71.02,60.96 71.02,63.4 R60.2 | R3.2 17.83,30.48 18.14,30.79 22.55,30.79 R74.2 35.51,17.68 28.19,10.36 28.19,8.23 26.98,7.01 18.75,7.01 16.92,8.84 16.61,8.84 X2.1 | R28.2 17.83,85.19 21.03,85.19 21.95,86.11 34.59,86.11 35.51,85.19 R31.2 35.66,85.19 38.71,85.19 39.62,86.11 48.62,86.11 53.34,81.38 | R44.2 53.34,55.93 52.43,56.84 52.43,63.86 53.34,64.77 R41.2 52.43,69.49 52.43,76.66 53.34,77.57 R37.2 53.34,81.38 | R15.2 17.83,55.93 20.88,55.93 21.18,56.24 22.55,56.24 35.51,43.28 R12.2 | 53.34,81.38 54.25,82.3 61.27,82.3 62.18,81.38 71.02,81.38 R34.2
  Bottom 0.152: R64.2 89.92,59.44 89.92,68.89 89,69.8 89,72.39 R96.2 | R79.2 89,36.88 89,40.69 89.92,41.6 89.92,48.62 89,49.53 R57.2 | 71.17,68.58 71.17,63.55 R60.2 | 71.17,68.58 72.08,69.49 72.08,76.5 71.17,77.42 71.17,81.23 R34.2 | 71.17,68.58 R38.2 | R52.2 71.17,20.42 71.17,25.3 R81.2 72.08,26.36 | 72.08,26.36 72.08,29.57 71.17,30.48 71.17,34.29 R76.2 71.02,34.29 70.1,35.2 55.47,35.2 54.56,34.29 R47.2 | 72.08,26.36 77.88,26.36 80.01,24.23 88.85,24.23 R50.2 | R15.2 16.76,54.86 16.76,48.01 17.68,47.09 17.68,43.28 R9.2 17.83,43.28 21.03,43.28 21.18,43.43 22.71,43.43 26.67,39.47 26.67,31.39 | R3.2 20.88,30.48 21.79,31.39 26.67,31.39 | 26.67,31.39 34.59,31.39 35.51,30.48 R6.2 | 36.58,54.25 36.58,54.86 R18.2 35.66,55.93 35.66,59.74 36.58,60.66 36.58,67.67 35.66,68.58 R24.2 35.51,68.58 30.79,73.3 24.99,73.3 20.27,68.58 R21.2 | 36.58,54.25 36.58,48.01 35.66,47.09 35.66,43.28 R12.2 | R54.2 53.34,49.53 52.43,50.44 52.43,54.25 | 52.43,54.25 52.43,54.86 53.34,55.78 R44.2 | 52.43,54.25 36.58,54.25
WE
  Top 0.152: R43.1 43.13,59.59 42.22,58.67 42.22,46.63 43.13,45.72 43.13,41.91 R45.1 43.28,41.91 44.81,40.39 44.81,25.3 34.29,14.78 X3.1
WE2  (via drill 0.35)
  Top 0.152: v52.12,38.25 52.12,32.16 39.47,19.51 39.47,8.99 X3.3
  Bottom 0.152: R59.1 60.96,59.59 59.74,58.37 59.74,44.81 60.96,43.59 R61.1 59.44,40.39 54.25,40.39 v52.12,38.25

### Text on the board
tPlace: BitUCounter v1 ©2018 William Woody | D | LD | RST | UP | OU | WE1 | WO1 | WE2 | WO2 | OUT | VCC | GND